# EAGLE board Respeaker Microphone Array v1.0 (EAGLE 7.3.0), part 1 of 2
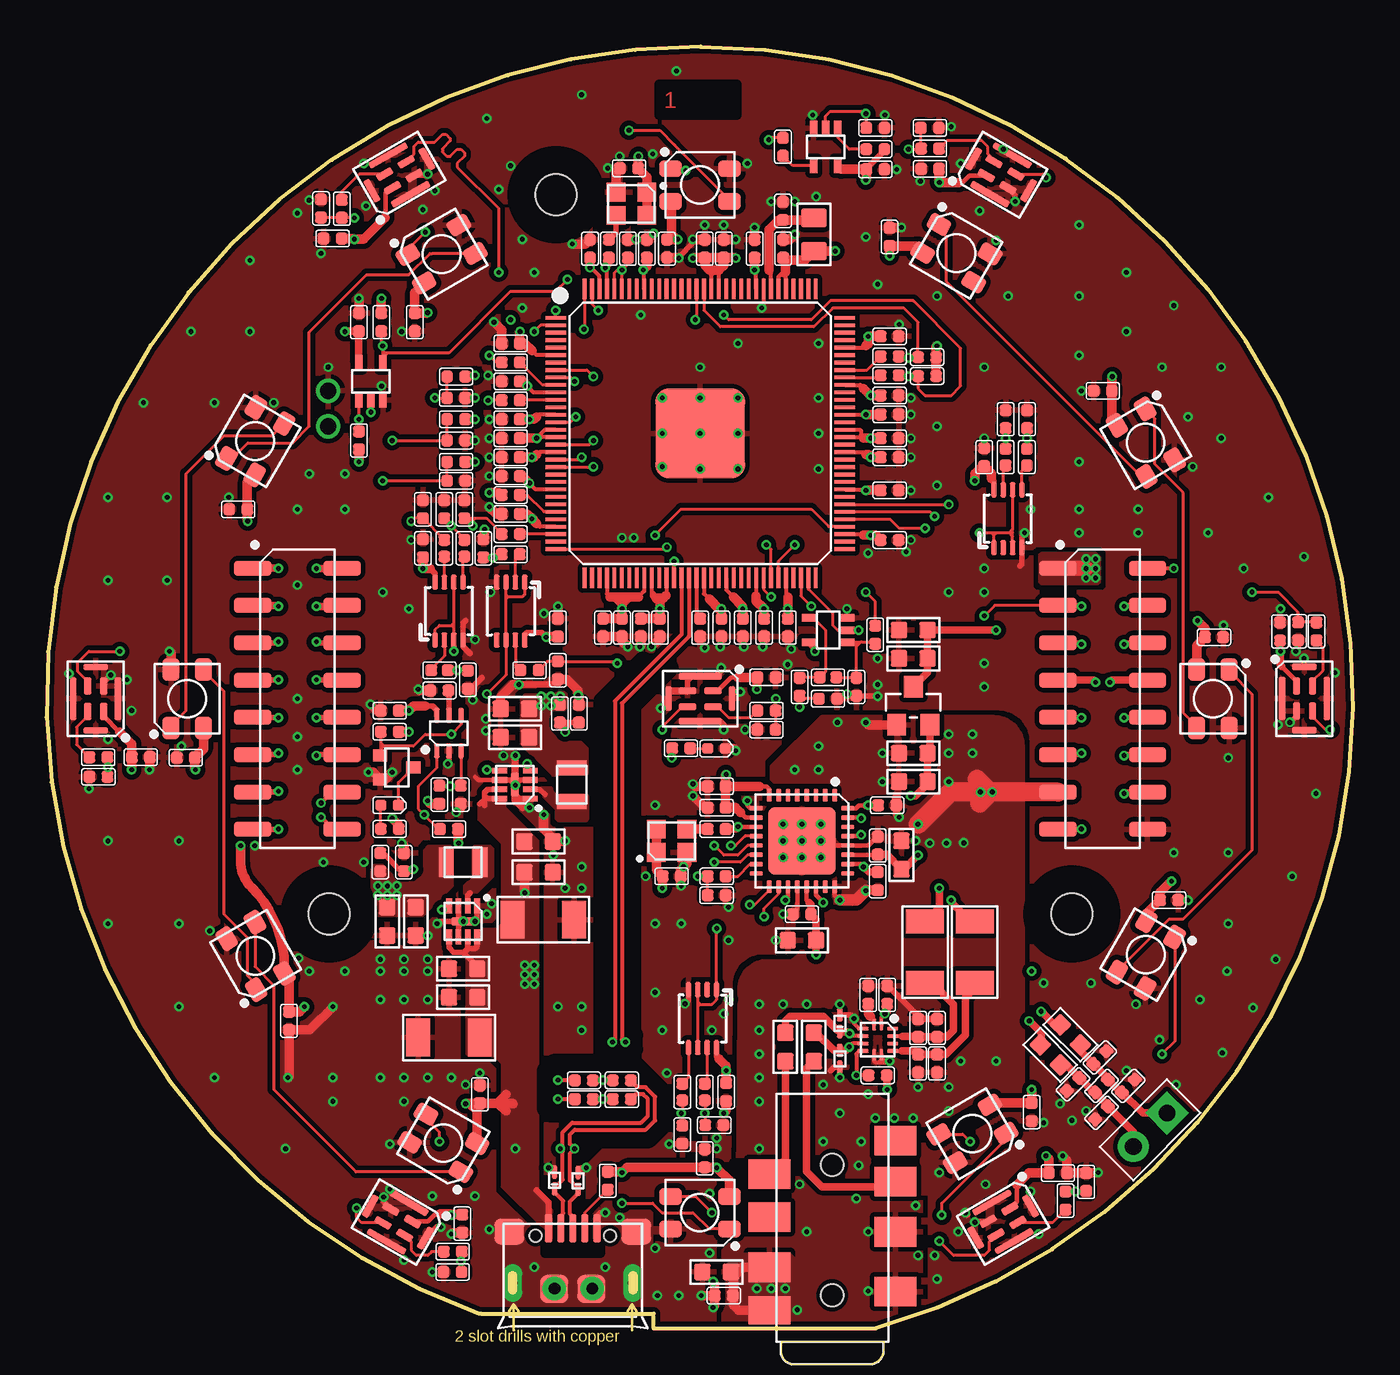
[diagram p5: board, top side]
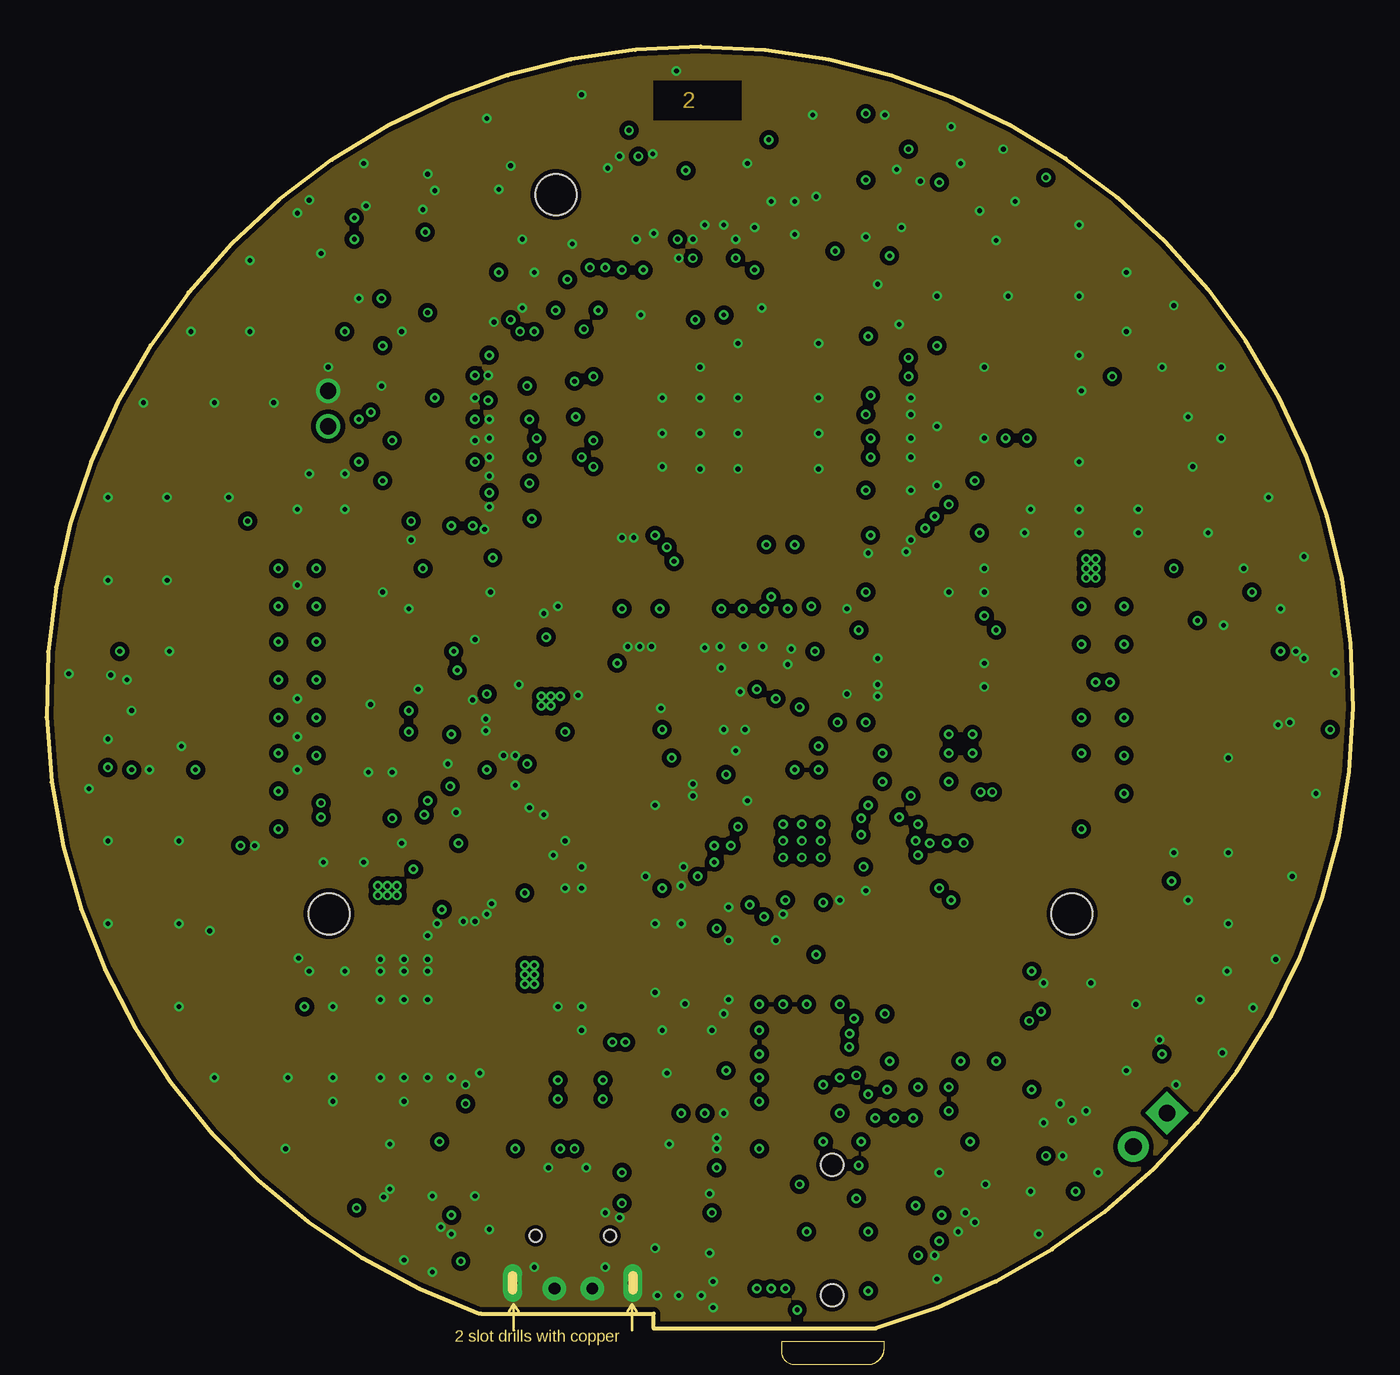
[diagram p6: board, inner layer GND]
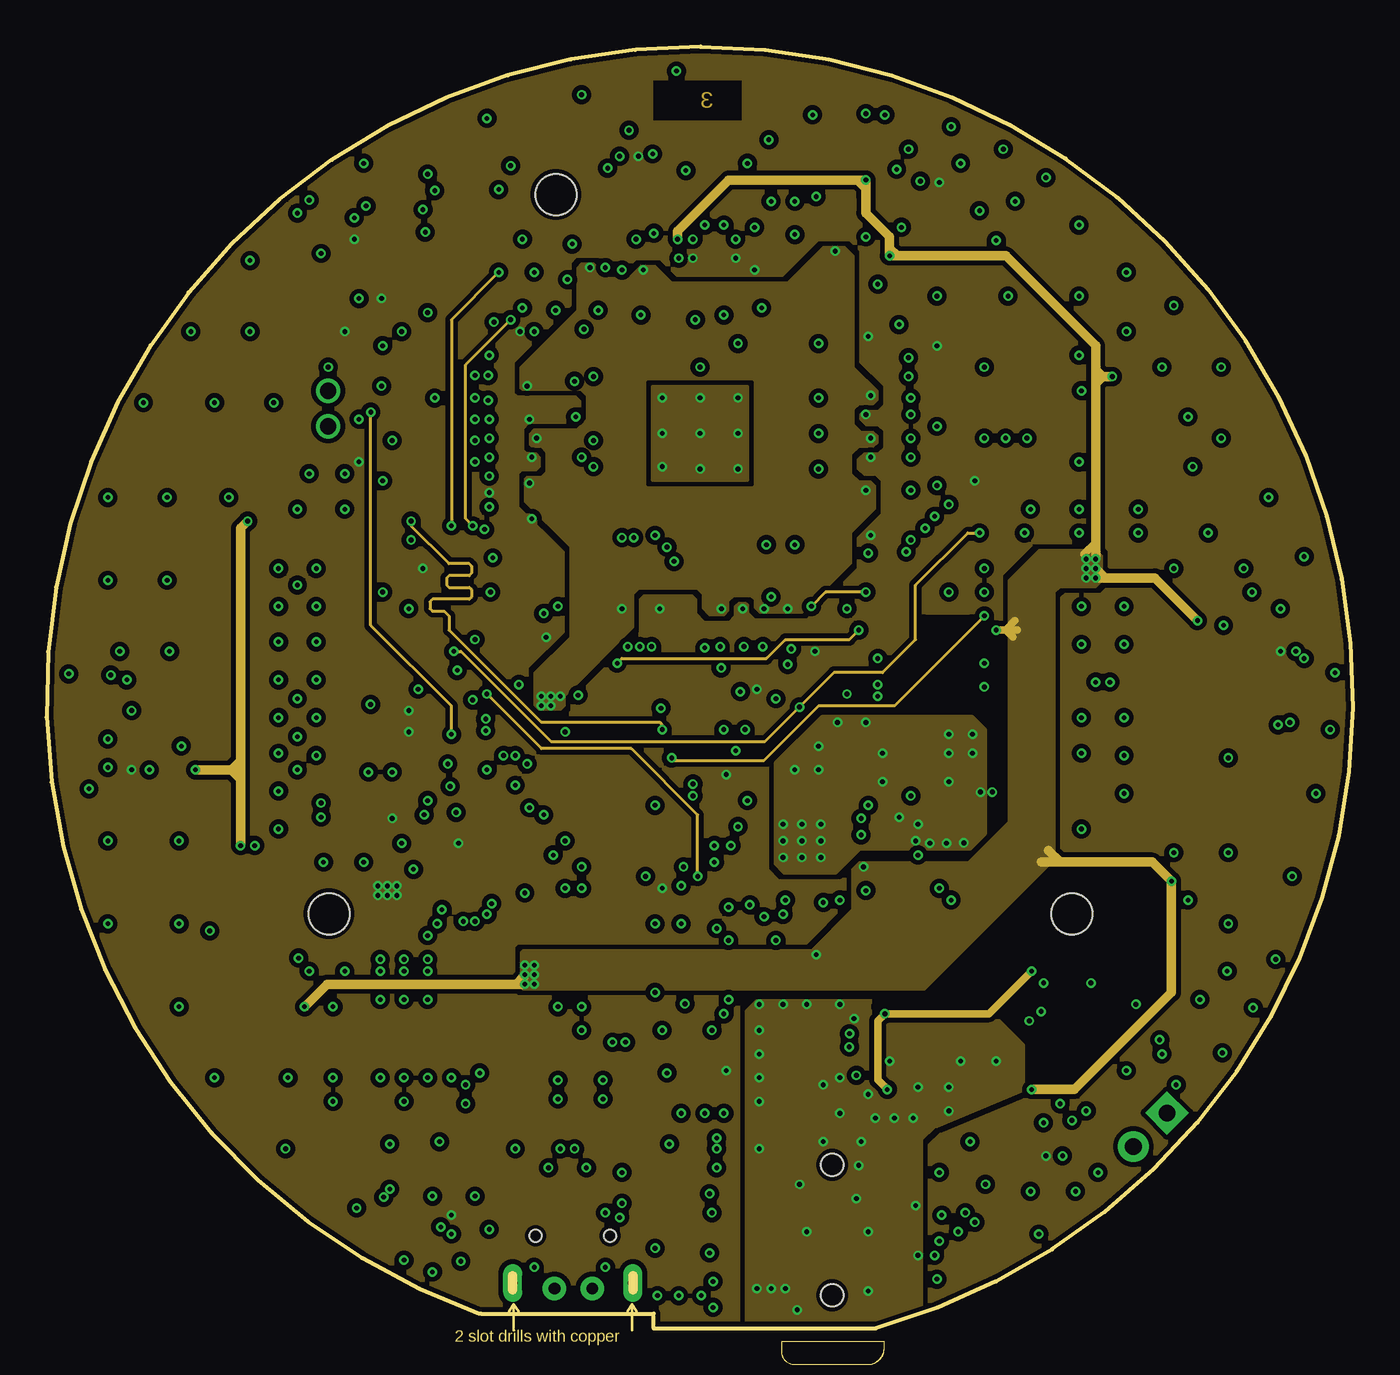
[diagram p7: board, inner layer PWR]
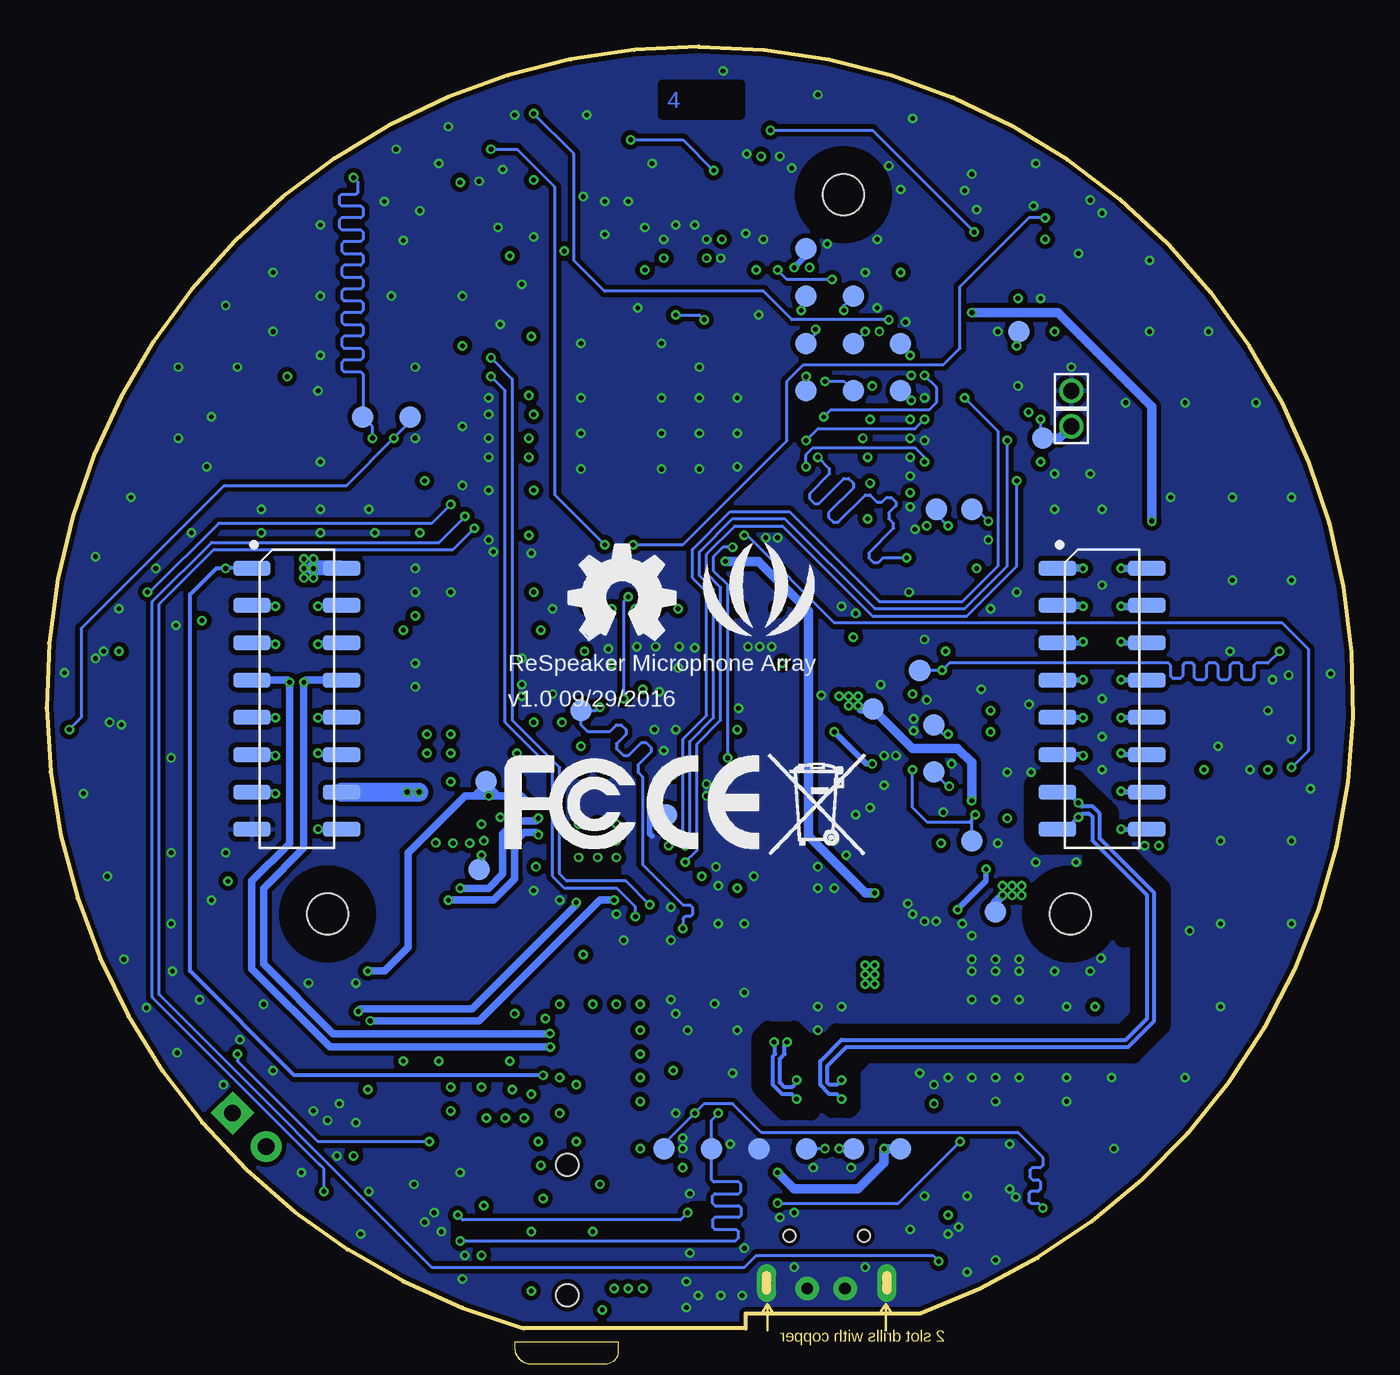
[diagram p8: board, bottom side, seen from below]

Size 70.04 x 68.72 mm. Coordinates in mm from the lower left corner, seen from the top.
Outline: 32.55,0 44.46,0
Outline: 23.28,0.79 32.55,0.79 32.55,0.03
Outline: 35.06,68.72 arc-164 44.47,0.01
Outline: 35.06,68.71 arc161 23.23,0.79
Copper layers (1*2*15*16): Top 0.035mm / dielectric 0.2mm / GND 0.0175mm / dielectric 0.3mm / PWR 0.0175mm / dielectric 0.2mm / Bottom 0.035mm
Design rules "SeeedStudio_4layer_DRU_no_angle_20140221 *": minimum track width 1mil, minimum drill 8mil, track to track 6mil, track to pad 6mil, pad to pad 6mil, via to via 6mil, smd to smd 0mil, copper to edge 10mil, drill to drill 8mil, minimum pad ring 6mil, minimum via ring 4mil, stop-mask expansion 4mil, vias tented up to drill 25mil, thermal gap 10mil
Net classes: 0 default: width 0.025 mm, drill 0.203 mm, clearance 0.102 mm
Holes 2.2 mm at 15.14,22.22 54.98,22.22 27.3,60.78
tRestrict: area 22.1,24.2 to 22.5,25.8; area 27.4,28.9 to 28.9,29.4; area 52.6,19.9 to 57.3,24.6; area 12.8,19.9 to 17.5,24.6; area 25,58.4 to 29.7,63.1; area 32.8,65 to 37,66.7; area 36.8,8.2 to 37.3,8.9; area 48.2,10.2 to 50.3,11.9; area 34.9,25.2 to 35.4,25.8; 19 lines
bRestrict: area 52.6,19.9 to 57.3,24.6; area 12.8,19.9 to 17.5,24.6; area 25,58.4 to 29.7,63.1; area 32.8,65 to 37,66.7; area 39.5,24.2 to 41.8,24.9; area 35.5,5.1 to 48.1,5.6; area 34.7,6.1 to 35.4,6.6; 33 lines

## Footprints (pad centres in the part's own frame; a part is rotated, then mirrored left to right if it is on the bottom)
TP-D45MIL = smd 1.143 x 1.143: T 0,0
C0402 = smd 0.635 x 0.635: 1 0,0.484; 2 0,-0.484
C0603 = smd 0.889 x 0.889: 1 0,0.762; 2 0,-0.762
C1206 = smd 1.27 x 2.032: 1 -1.651,0; 2 1.651,0
SOD-923 = smd 0.7 x 0.3: 1 -0.45,0; 2 0.45,0
LED-0402 = smd 0.58 x 0.58: + -0.468,0; - 0.468,0
MICRO-USB5+4P-SMD-0.65-B = smd 0.381 x 1.524: 1 -1.3,-0.25; 2 -0.65,-0.25; 3 0,-0.25; 4 0.65,-0.25; 5 1.3,-0.25 | smd 1.6 x 1.397: S1 -3.4,-0.427; S6 3.4,-0.427 | drill 0.508 pad 1.016 long: S2 -3.226,-3.175; S5 3.226,-3.175 | smd 1.5 x 1.5: S3 -1,-3.5; S4 1,-3.5 | hole 0.635: -2,-0.65; 2,-0.65
H2X8-SMD-2.0 = smd 2 x 0.8: 1 -2.4,7; 2 2.4,7; 3 -2.4,5; 4 2.4,5; 5 -2.4,3; 6 2.4,3; 7 -2.4,1; 8 2.4,1; 9 -2.4,-1; 10 2.4,-1; 11 -2.4,-3; 12 2.4,-3; 13 -2.4,-5; 14 2.4,-5; 15 -2.4,-7; 16 2.4,-7
1P-40/25MIL = drill 0.864 pad 1.27: 1 0,0
AUDIO8P-SMD-3.5-14.5X6.1X4.0MM = smd 1.6 x 2.25: 1 3.9,-3.375; 2 7.1,-3.375; 3 9.8,-3.375; 4 10.2,3.375; 6 5.2,3.375; 7 7.9,3.375; 8 12,-3.375 | smd 1.5 x 2.25: 5 2.9,3.375 | hole 1.2: 3.7,0; 10.7,0
H2-2.54 = drill 0.889 pad 1.651 square: 1 0,1.27 | drill 0.889 pad 1.651: 2 0,-1.27
L201610 = smd 0.8 x 1.6: 1 -0.9,0; 2 0.9,0
L0603 = smd 0.889 x 0.889: 1 -0.762,0; 2 0.762,0
HCLGA5P-3X4X1MM = smd 0.95 x 0.4: 1 -0.675,-0.425; 2 0.675,-0.425; 3 0.675,0.425; 4 -0.675,0.425 | smd 2.3 x 0.35: 5 0,-1.2; 7 0,1.2 | smd 0.35 x 1.3: 6 1.7,0; 8 -1.7,0
SOT-323 = smd 0.635 x 0.762: 1 -0.635,-0.889; 2 0.635,-0.889; 3 0,0.889
R0402 = smd 0.635 x 0.635: 1 0,0.484; 2 0,-0.484
R0805 = smd 1.397 x 1.016: 1 0,0.889; 2 0,-0.889
R0402' = smd 0.635 x 0.635: 1 0,0.445; 2 0,-0.445
LED4-SMD-3.5X3.7MM = smd 1.2 x 0.9: 1 -1.58,0.875; 2 -1.58,-0.875; 3 1.58,-0.875; 4 1.58,0.875
LEAD12P-SMD-0.4-1.8X1.8X0.5MM = smd 0.6 x 0.2: 1 -0.8,0.2; 2 -0.8,-0.2; 7 0.8,-0.2; 8 0.8,0.2 | smd 0.2 x 0.6: 3 -0.6,-0.8; 4 -0.2,-0.8; 5 0.2,-0.8; 6 0.6,-0.8; 9 0.6,0.8; 10 0.2,0.8; 11 -0.2,0.8; 12 -0.6,0.8
TQFP128-0.4-14X14MM = smd 1.1 x 0.2: 1 -7.75,6.2; 2 -7.75,5.8; 3 -7.75,5.4; 4 -7.75,5; 5 -7.75,4.6; 6 -7.75,4.2; 7 -7.75,3.8; 8 -7.75,3.4; 9 -7.75,3; 10 -7.75,2.6; 11 -7.75,2.2; 12 -7.75,1.8; 13 -7.75,1.4; 14 -7.75,1; 15 -7.75,0.6; 16 -7.75,0.2; 17 -7.75,-0.2; 18 -7.75,-0.6; 19 -7.75,-1; 20 -7.75,-1.4; 21 -7.75,-1.8; 22 -7.75,-2.2; 23 -7.75,-2.6; 24 -7.75,-3; 25 -7.75,-3.4; 26 -7.75,-3.8; 27 -7.75,-4.2; 28 -7.75,-4.6; 29 -7.75,-5; 30 -7.75,-5.4; 31 -7.75,-5.8; 32 -7.75,-6.2; 65 7.75,-6.2; 66 7.75,-5.8; 67 7.75,-5.4; 68 7.75,-5; 69 7.75,-4.6; 70 7.75,-4.2; 71 7.75,-3.8; 72 7.75,-3.4; 73 7.75,-3; 74 7.75,-2.6; 75 7.75,-2.2; 76 7.75,-1.8; 77 7.75,-1.4; 78 7.75,-1; 79 7.75,-0.6; 80 7.75,-0.2; 81 7.75,0.2; 82 7.75,0.6; 83 7.75,1; 84 7.75,1.4; 85 7.75,1.8; 86 7.75,2.2; 87 7.75,2.6; 88 7.75,3; 89 7.75,3.4; 90 7.75,3.8; 91 7.75,4.2; 92 7.75,4.6; 93 7.75,5; 94 7.75,5.4; 95 7.75,5.8; 96 7.75,6.2 | smd 0.2 x 1.1: 33 -6.2,-7.75; 34 -5.8,-7.75; 35 -5.4,-7.75; 36 -5,-7.75; 37 -4.6,-7.75; 38 -4.2,-7.75; 39 -3.8,-7.75; 40 -3.4,-7.75; 41 -3,-7.75; 42 -2.6,-7.75; 43 -2.2,-7.75; 44 -1.8,-7.75; 45 -1.4,-7.75; 46 -1,-7.75; 47 -0.6,-7.75; 48 -0.2,-7.75; 49 0.2,-7.75; 50 0.6,-7.75; 51 1,-7.75; 52 1.4,-7.75; 53 1.8,-7.75; 54 2.2,-7.75; 55 2.6,-7.75; 56 3,-7.75; 57 3.4,-7.75; 58 3.8,-7.75; 59 4.2,-7.75; 60 4.6,-7.75; 61 5,-7.75; 62 5.4,-7.75; 63 5.8,-7.75; 64 6.2,-7.75; 97 6.2,7.75; 98 5.8,7.75; 99 5.4,7.75; 100 5,7.75; 101 4.6,7.75; 102 4.2,7.75; 103 3.8,7.75; 104 3.4,7.75; 105 3,7.75; 106 2.6,7.75; 107 2.2,7.75; 108 1.8,7.75; 109 1.4,7.75; 110 1,7.75; 111 0.6,7.75; 112 0.2,7.75; 113 -0.2,7.75; 114 -0.6,7.75; 115 -1,7.75; 116 -1.4,7.75; 117 -1.8,7.75; 118 -2.2,7.75; 119 -2.6,7.75; 120 -3,7.75; 121 -3.4,7.75; 122 -3.8,7.75; 123 -4.2,7.75; 124 -4.6,7.75; 125 -5,7.75; 126 -5.4,7.75; 127 -5.8,7.75; 128 -6.2,7.75 | smd 4.8 x 4.8: PAD 0,0
DFN8G-0.5-2X2MM = smd 0.8 x 0.3: 1 -0.827,0.75; 2 -0.827,0.25; 3 -0.827,-0.25; 4 -0.827,-0.75; 5 0.827,-0.75; 6 0.827,-0.25; 7 0.827,0.25; 8 0.827,0.75 | smd 0.45 x 1.3: 9 0,0
SOT-353 = smd 0.4 x 0.8: 1 -0.65,-1; 2 0,-1; 3 0.65,-1; 4 0.65,1; 5 -0.65,1
SC-70-6 = smd 0.3 x 0.8: 1 -0.65,-0.95; 2 0,-0.95; 3 0.65,-0.95; 4 0.65,0.95; 5 0,0.95; 6 -0.65,0.95
QFN32G-0.5-5X5MM = smd 0.7 x 0.25: 1 -2.45,1.75; 2 -2.45,1.25; 3 -2.45,0.75; 4 -2.45,0.25; 5 -2.45,-0.25; 6 -2.45,-0.75; 7 -2.45,-1.25; 8 -2.45,-1.75; 17 2.45,-1.75; 18 2.45,-1.25; 19 2.45,-0.75; 20 2.45,-0.25; 21 2.45,0.25; 22 2.45,0.75; 23 2.45,1.25; 24 2.45,1.75 | smd 0.25 x 0.7: 9 -1.75,-2.45; 10 -1.25,-2.45; 11 -0.75,-2.45; 12 -0.25,-2.45; 13 0.25,-2.45; 14 0.75,-2.45; 15 1.25,-2.45; 16 1.75,-2.45; 25 1.75,2.45; 26 1.25,2.45; 27 0.75,2.45; 28 0.25,2.45; 29 -0.25,2.45; 30 -0.75,2.45; 31 -1.25,2.45; 32 -1.75,2.45 | smd 3.6 x 3.6: 33 0,0
SOT-23 = smd 1.016 x 1.143: 1 -0.889,-1.016; 2 0.889,-1.016; 3 0,1.016
US-8 = smd 0.8 x 0.3: 1 -1.55,0.75; 2 -1.55,0.25; 3 -1.55,-0.25; 4 -1.55,-0.75; 5 1.55,-0.75; 6 1.55,-0.25; 7 1.55,0.25; 8 1.55,0.75
OSC-SMD-2.5X2.0X0.9MM = smd 1 x 1: 1 -0.825,-0.625; 2 0.825,-0.625; 3 0.825,0.625; 4 -0.825,0.625

## Placement (x,y rotation side)
1V  [TP-D45MIL]  25.74,33.21 90 bottom
3V3  [TP-D45MIL]  19.17,22.34 180 bottom
24M  [TP-D45MIL]  29.33,57.89 270 bottom
24M_1  [TP-D45MIL]  36.81,27.53 0 bottom
ADM_VIN  [TP-D45MIL]  22.46,29.82 270 bottom
C1  100nF  [C0402]  36.43,12.67 180 top
C2  100nF  [C0402]  33.51,24.23 270 top
C3  10uF  [C0603]  46.47,37.44 90 top
C4  100nF  [C0402]  44.56,25.88 0 top
C5  100nF  [C0402]  27.41,37.57 0 top
C6  10uF  [C0603]  22.33,19.28 90 top
C7  10uF  [C0603]  22.33,17.75 90 top
C8  10uF  [C0603]  18.27,21.82 180 top
C9  10uF  [C0603]  19.79,21.82 180 top
C10  100uF 10V  [C1206]  21.57,15.6 0 top
C11  100nF  [C0402]  19.73,53.95 180 top
C12  100nF  [C0402]  10.27,43.91 90 top
C13  100nF  [C0402]  7.46,30.6 90 top
C14  100nF  [C0402]  13,16.49 180 top
C15  100nF  [C0402]  23.23,12.55 0 top
C16  100nF  [C0402]  35.29,9.12 0 top
C17  10uF  [C0603]  46.47,35.92 90 top
C18  10uF  [C0603]  25.11,31.69 90 top
C19  10uF  [C0603]  26.38,26.1 270 top
C20  10uF  [C0603]  25.11,33.21 90 top
C21  10uF  [C0603]  26.38,24.45 270 top
C22  100uF 10V  [C1206]  26.63,21.91 180 top
C23  100nF  [C0402]  39.48,59.91 0 top
C24  100nF  [C0402]  31.23,62.2 90 top
C25  100nF  [C0402]  45.2,44.93 270 top
C26  100nF  [C0402]  32.18,57.89 0 top
C27  100nF  [C0402]  45.2,50.01 270 top
C28  100nF  [C0402]  24.88,47.73 90 top
C29  100nF  [C0402]  24.88,50.77 90 top
C30  100nF  [C0402]  45.2,47.73 270 top
C31  100nF  [C0402]  39.49,57.89 0 top
C32  100nF  [C0402]  29.14,57.89 0 top
C33  100nF  [C0402]  24.88,45.69 90 top
C34  100nF  [C0402]  29.83,37.57 180 top
C35  100nF  [C0402]  30.85,37.57 180 top
C36  100nF  [C0402]  36.18,37.57 180 top
C37  100nF  [C0402]  38.47,37.57 180 top
C38  100nF  [C0402]  39.74,37.57 180 top
C39  100nF  [C0402]  35.3,57.89 0 top
C40  100nF  [C0402]  24.88,43.66 90 top
C41  100nF  [C0402]  32.88,37.57 180 top
C42  100nF  [C0402]  31.87,37.57 180 top
C43  100nF  [C0402]  24.88,46.71 90 top
C44  100nF  [C0402]  24.88,48.74 90 top
C45  100nF  [C0402]  24.88,52.81 90 top
C46  100nF  [C0402]  37.33,37.57 180 top
C47  100nF  [C0402]  45.2,42.27 270 top
C48  100nF  [C0402]  45.2,46.71 270 top
C49  100nF  [C0402]  45.2,49 270 top
C50  100nF  [C0402]  45.2,53.19 270 top
C51  100nF  [C0402]  37.96,57.89 0 top
C52  100nF  [C0402]  36.31,57.89 0 top
C53  100nF  [C0402]  52.82,11.6 180 top
C54  100nF  [C0402]  60.18,22.97 270 top
C55  100nF  [C0402]  38.6,34.9 270 top
C56  100nF  [C0402]  15.33,58.43 90 top
C57  100nF  [C0402]  5.05,30.63 270 top
C58  100nF  [C0402]  22.28,5.62 180 top
C59  100nF  [C0402]  54.22,8.33 270 top
C60  100nF  [C0402]  66.13,37.36 0 top
C61  100nF  [C0402]  47.37,62.17 90 top
C62  100nF  [C0402]  44.56,23.98 180 top
C63  2.2nF  [C0402]  21.06,34.2 90 top
C64  100nF  [C0402]  18.4,33.12 90 top
C65  100nF  [C0402]  16.74,53.95 0 top
C66  100nF  [C0402]  31.17,57.89 0 top
C67  100nF  [C0402]  50.27,46.71 0 top
C68  10uF  [C0603]  46.47,30.84 90 top
C69  100nF  [C0402]  40.5,22.2 90 top
C70  100nF  [C0402]  20.18,41.82 0 top
C71  10uF  [C0603]  46.47,29.31 90 top
C72  100nF  [C0402]  62.59,37.06 270 top
C73  100nF  [C0402]  56.63,50.26 90 top
C74  100nF  [C0402]  45.19,58.52 0 top
C75  100nF  [C0402]  33.26,57.89 180 top
C76  100nF  [C0402]  44.43,62.14 270 top
C77  1.5nF  [C0402]  22.4,43.92 180 top
C78  100pF  [C0402]  35.92,23.22 270 top
C79  100nF  [C0402]  45.07,17.88 0 top
C80  1.5nF  [C0402]  21.95,45.44 90 top
C81  100nF  [C0402]  44.05,17.88 0 top
C82  1.5nF  [C0402]  21.95,47.6 90 top
C83  1.5nF  [C0402]  21.95,49.89 90 top
C84  100pF  [C0402]  23.42,41.82 0 top
C85  100pF  [C0402]  27.42,35.28 180 top
C86  470pF  [C0402]  41.89,33.76 270 top
C87  470pF  [C0402]  22.59,34.77 180 top
C88  100nF  [C0402]  35.92,29.06 90 top
C89  100nF  [C0402]  45.07,28.04 270 top
C90  100uF 10V  [C1206]  49.77,20.17 270 top
C91  100uF 10V  [C1206]  47.1,20.17 270 top
C92  100pF  [C0402]  46.72,16.1 0 top
C93  100pF  [C0402]  46.72,14.2 180 top
C94  470pF  [C0402]  21.32,43.92 0 top
C95  100pF  [C0402]  55.03,13.08 135 top
C96  100pF  [C0402]  56.47,14.52 315 top
C97  680nF DNP  [C0402]  56.56,12.99 315 top
C98  100pF  [C0402]  56.56,11.56 135 top
C99  100pF  [C0402]  58,12.99 315 top
C100  10uF  [C0603]  40.5,20.8 270 top
C101  470pF  [C0402]  20.18,43.92 0 top
C102  10uF  [C0603]  45.83,25.37 180 top
C103  470pF  [C0402]  34.08,10.39 180 top
C104  470pF  [C0402]  35.8,10.9 270 top
C105  470pF  [C0402]  52.56,48.74 0 top
C106  470pF  [C0402]  51.42,48.74 0 top
C107  100nF  [C0402]  35.92,27.91 90 top
C108  470pF  [C0402]  43.42,34.39 180 top
C109  DNP 330pF  [C0402]  67.1,37.38 180 top
C110  DNP 330pF  [C0402]  55.74,7.85 0 top
C111  DNP 330pF  [C0402]  21.76,3.02 90 top
C112  DNP 330pF  [C0402]  2.78,29.57 90 top
C113  DNP 330pF  [C0402]  38.59,32.11 90 top
C114  DNP 330pF  [C0402]  14.72,60.05 0 top
C115  DNP 330pF  [C0402]  47.35,64.36 270 top
D1  DF2S6.8FS  [SOD-923]  42.53,16.36 90 top
D2  DF2S6.8FS  [SOD-923]  42.53,14.45 270 top
D7  TOSHIBA;DF2S6.8FS(TL4,D)  [SOD-923]  27.23,7.92 90 top
D8  TOSHIBA;DF2S6.8FS(TL4,D)  [SOD-923]  28.49,7.9 90 top
D9  LED_RED  [LED-0402]  35.92,31.09 0 top
D11  LED_GREEN  [LED-0402]  18.4,28.04 0 top
DM  [TP-D45MIL]  26.77,9.63 270 bottom
DP  [TP-D45MIL]  29.31,9.63 270 bottom
FR1  [SEEEDSTUDIO-PCB-FRAME]  89.77,44.81 0 top  (outside the outline)
FR2  [SEEEDSTUDIO-PCB-FRAME]  94.34,12.29 0 top  (outside the outline)
FR3  [SEEEDSTUDIO-PCB-FRAME]  92.31,34.52 0 top  (outside the outline)
FR4  [SEEEDSTUDIO-PCB-FRAME]  92.06,23.22 0 top  (outside the outline)
FR5  [SEEEDSTUDIO-PCB-FRAME]  91.68,61.19 0 top  (outside the outline)
FR7  [SEEEDSTUDIO-PCB-FRAME]  89.26,5.69 0 top  (outside the outline)
FR8  [SEEEDSTUDIO-PCB-FRAME]  88.76,-0.91 0 top  (outside the outline)
GND  [TP-D45MIL]  31.85,9.63 270 bottom
GND1  [TP-D45MIL]  24.25,9.63 0 bottom
J1  DNP 320010000  [MICRO-USB5+4P-SMD-0.65-B]  28.21,5.61 0 top
J2  320030443  [H2X8-SMD-2.0]  13.45,33.76 0 bottom
J3  320030443  [H2X8-SMD-2.0]  56.63,33.76 0 bottom
J4  [1P-40/25MIL]  15.1,50.27 0 bottom
J5  320030443  [H2X8-SMD-2.0]  13.45,33.76 0 top
J6  320030443  [H2X8-SMD-2.0]  56.63,33.76 0 top
J7  [1P-40/25MIL]  15.1,48.36 0 bottom
J9  DNP AUDIO-JACK-8P-SMD  [AUDIO8P-SMD-3.5-14.5X6.1X4.0MM]  42.12,-1.93 90 top
J10  DNP  [H2-2.54]  59.17,10.64 315 top
L1  0.47uH  [L201610]  22.33,24.99 180 top
L2  0.47uH  [L201610]  28.15,29.15 90 top
L3  BLM18BD252SN1  [L0603]  41.13,15.09 270 top
L4  BLM18BD252SN1  [L0603]  39.61,15.09 270 top
L5  DNP  [L0603]  35.92,3.02 0 top
L6  BLM18BD252SN1  [L0603]  54.89,15.74 315 top
L7  BLM18BD252SN1  [L0603]  53.81,14.66 315 top
MIC7  MP34DT01  [HCLGA5P-3X4X1MM]  35.04,33.76 180 top
MIC8  MP34DT01  [HCLGA5P-3X4X1MM]  18.91,61.85 30 top
MIC9  MP34DT01  [HCLGA5P-3X4X1MM]  2.63,33.76 90 top
MIC10  MP34DT01  [HCLGA5P-3X4X1MM]  18.83,5.69 150 top
MIC11  MP34DT01  [HCLGA5P-3X4X1MM]  51.28,5.71 210 top
MIC12  MP34DT01  [HCLGA5P-3X4X1MM]  67.44,33.77 270 top
MIC13  MP34DT01  [HCLGA5P-3X4X1MM]  51.17,61.85 330 top
MIC_CLK0  [TP-D45MIL]  20.43,43.91 270 bottom
MIC_CLK1  [TP-D45MIL]  22.34,43.91 270 bottom
MIC_CLK2  [TP-D45MIL]  23.23,35.28 270 bottom
MIC_CLK3  [TP-D45MIL]  36.94,9.62 270 bottom
MIC_CLK4  [TP-D45MIL]  34.4,9.62 270 bottom
MIC_CLK5  [TP-D45MIL]  50.54,48.86 90 bottom
MIC_CLK6  [TP-D45MIL]  53.08,48.86 90 bottom
PG  [TP-D45MIL]  20.43,26.13 180 bottom
PMCK  [TP-D45MIL]  41.39,33.12 180 bottom
POR  [TP-D45MIL]  22.47,32.36 270 bottom
Q1  CJ2102  [SOT-323]  18.78,30.07 270 top
R1  33R  [R0402]  30.15,57.89 0 top
R2  10K  [R0402]  16.75,47.6 0 top
R3  10k  [R0402]  47.74,16.1 0 top
R4  0R  [R0402]  30.84,13.3 90 top
R5  100K_1%  [R0402]  17.89,24.99 0 top
R6  43.2R  [R0402]  35.04,37.57 180 top
R7  22K_1%  [R0402]  19.16,24.99 0 top
R8  0R  [R0402]  28.81,13.3 90 top
R9  0R  [R0402]  28.81,12.28 90 top
R10  20K_1%  [R0402]  27.52,32.96 180 top
R11  30K_1%  [R0402]  28.54,32.96 0 top
R12  33R  [R0402]  24.88,51.79 270 top
R13  4.7R  [R0805]  41.14,58.65 0 top
R14  33R  [R0402]  24.88,49.76 270 top
R15  10k  [R0402]  47.21,52.07 90 top
R16  10k  [R0402]  47.21,51.06 90 top
R17  1k  [R0402]  24.88,44.68 270 top
R18  33R  [R0402]  35.92,24.23 270 top
R19  33R  [R0402]  35.92,26.77 90 top
R20  100k  [R0402]  44.56,13.56 270 top
R21  10K  [R0402]  21.57,26.77 90 top
R22  10K  [R0402]  22.21,28.61 180 top
R23  3.9k  [R0402]  21.06,28.61 0 top
R24  10K  [R0402]  18.4,31.98 90 top
R25  470R  [R0402]  18.4,26.78 90 top
R26  33R  [R0402']  22.4,41.82 180 top
R27  10K  [R0402]  17.94,53.95 180 top
R28  33R  [R0402']  21.06,35.28 90 top
R29  33R  [R0402']  21.32,41.82 180 top
R30  33R  [R0402']  35.29,12.67 0 top
R31  33R  [R0402']  34.08,12.67 0 top
R32  0R  [R0402]  36.31,1.75 90 top
R33  33R  [R0402]  21.95,51.03 90 top
R34  470R  [R0402]  34.02,31.09 270 top
R35  10K  [R0402]  44.43,63.22 90 top
R36  0R DNP  [R0402]  45.2,51.09 270 top
R37  0R DNP  [R0402]  45.2,52.11 270 top
R38  0R  [R0402]  30.84,12.28 90 top
R39  10k  [R0402]  47.74,14.2 180 top
R40  33R  [R0402]  21.95,48.74 90 top
R41  33R  [R0402]  21.95,46.46 90 top
R42  DNP 0R  [R0402']  41.9,34.9 270 top
R43  DNP 10K  [R0402]  30.08,7.92 0 top
R44  33R  [R0402]  39.48,63.35 0 top
R45  10K  [R0402]  44.43,64.36 270 top
R46  33R  [R0402]  40.37,34.39 180 top
R47  33R  [R0402]  24.88,42.59 270 top
R48  33R  [R0402]  44.43,37.19 0 top
R49  33R  [R0402]  24.88,41.5 90 top
R50  33R  [R0402]  25.89,35.29 270 top
R52  33R  [R0402']  51.41,46.71 180 top
R53  33R  [R0402']  52.56,46.71 180 top
R58  33R  [R0402]  68.08,37.37 180 top
R60  33R  [R0402]  54.63,6.85 180 top
R61  33R  [R0402]  21.77,4.11 90 top
R62  33R  [R0402]  2.77,30.61 90 top
R63  33R  [R0402]  47.37,63.25 90 top
R64  33R  [R0402]  15.82,60.03 180 top
R65  33R  [R0402]  38.6,33.12 270 top
RST  [TP-D45MIL]  17.9,53.44 0 bottom
RST_N  [TP-D45MIL]  16.63,47.73 180 bottom
SK0  SK6812MINI  [LED4-SMD-3.5X3.7MM]  35.04,61.3 180 top
SK1  SK6812MINI  [LED4-SMD-3.5X3.7MM]  21.17,57.6 210 top
SK2  SK6812MINI  [LED4-SMD-3.5X3.7MM]  11.18,47.57 240 top
SK3  SK6812MINI  [LED4-SMD-3.5X3.7MM]  7.54,33.76 270 top
SK4  SK6812MINI  [LED4-SMD-3.5X3.7MM]  11.2,19.96 300 top
SK5  SK6812MINI  [LED4-SMD-3.5X3.7MM]  21.27,9.94 330 top
SK6  SK6812MINI  [LED4-SMD-3.5X3.7MM]  35.02,6.2 0 top
SK7  SK6812MINI  [LED4-SMD-3.5X3.7MM]  49.64,10.43 30 top
SK8  SK6812MINI  [LED4-SMD-3.5X3.7MM]  58.93,20.03 60 top
SK9  SK6812MINI  [LED4-SMD-3.5X3.7MM]  62.53,33.76 90 top
SK10  SK6812MINI  [LED4-SMD-3.5X3.7MM]  58.93,47.49 120 top
SK11  SK6812MINI  [LED4-SMD-3.5X3.7MM]  48.78,57.65 150 top
SW1  FSA2275  [LEAD12P-SMD-0.4-1.8X1.8X0.5MM]  44.56,15.47 270 top
TCK  [TP-D45MIL]  29.33,52.81 90 bottom
TDI  [TP-D45MIL]  26.79,52.81 90 bottom
TDO  [TP-D45MIL]  26.79,55.35 90 bottom
TMS  [TP-D45MIL]  29.33,55.35 90 bottom
TP4  [TP-D45MIL]  46.47,29.31 270 bottom
TP14  [TP-D45MIL]  46.85,24.61 180 bottom
U1  XVSM-2000  [TQFP128-0.4-14X14MM]  35.04,47.98 0 top
U2  ETA3410  [DFN8G-0.5-2X2MM]  22.33,21.82 270 top
U3  ETA3410  [DFN8G-0.5-2X2MM]  25.11,29.15 180 top
U4  74HC1G08  [SOT-353]  17.38,50.77 0 top
U5  ADM1085  [SC-70-6]  21.57,31.91 0 top
U6  WM8960  [QFN32G-0.5-5X5MM]  40.5,26.14 270 top
U7  AP7333  [SOT-23]  46.47,33.38 0 top
U8  74AHC1G79  [SOT-353]  41.9,37.44 90 top
U9  NC7NZ34  [US-8]  21.58,38.46 90 top
U10  NC7NZ34  [US-8]  35.16,16.61 270 top
U11  NC7NZ34  [US-8]  51.54,43.41 90 top
U12  NC7NZ34  [US-8]  24.88,38.46 270 top
U13  74HC1G08  [SOT-353]  41.77,63.35 180 top
U$36  [OSHW_FILLX200_NOTEXT_TNAME]  42.02,36.93 0 bottom
U$51  [SEEED-SILK-TNAME-280*268MIL]  31.86,38.84 0 bottom
X1  24MHz  [OSC-SMD-2.5X2.0X0.9MM]  31.35,60.29 180 top
X2  24MHz  [OSC-SMD-2.5X2.0X0.9MM]  33.51,26.14 0 top
XL_DN0  [TP-D45MIL]  26.79,50.27 90 bottom
XL_DN1  [TP-D45MIL]  29.33,50.27 90 bottom
XL_UP0  [TP-D45MIL]  24.25,52.81 90 bottom
XL_UP1  [TP-D45MIL]  24.25,50.27 90 bottom